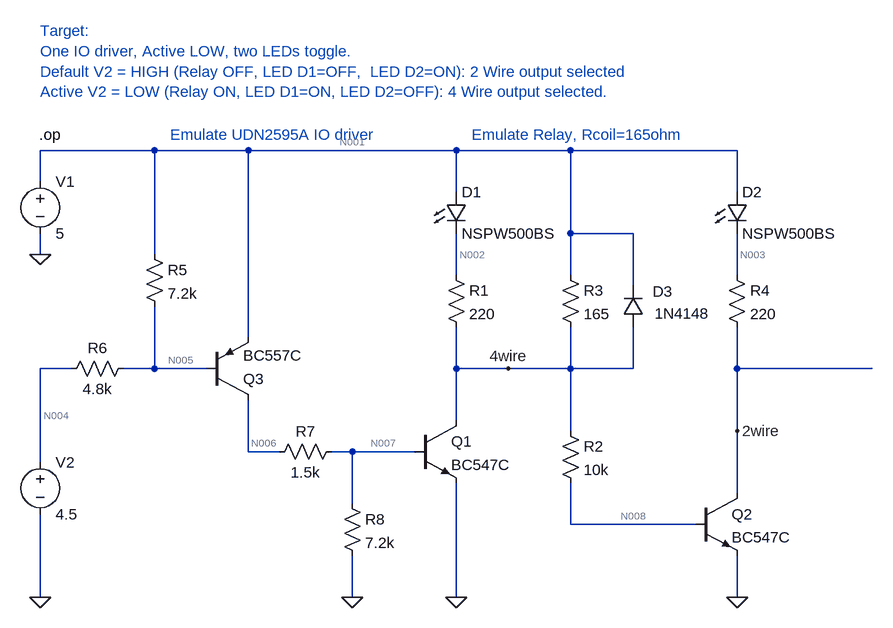
[diagram p0: schematic 2wire4wire_LED.asc]
2wire4wire_LED.asc, the LTspice schematic file:
Version 4
SHEET 1 948 680
WIRE -240 -256 -416 -256
WIRE -96 -256 -240 -256
WIRE 224 -256 -96 -256
WIRE 400 -256 224 -256
WIRE 656 -256 400 -256
WIRE -416 -208 -416 -256
WIRE 224 -192 224 -256
WIRE 656 -192 656 -256
WIRE 400 -128 400 -256
WIRE 496 -128 400 -128
WIRE -416 -96 -416 -128
WIRE -240 -96 -240 -256
WIRE 224 -64 224 -128
WIRE 400 -64 400 -128
WIRE 656 -64 656 -128
WIRE 496 -48 496 -128
WIRE -96 32 -96 -256
WIRE -368 80 -416 80
WIRE -240 80 -240 -16
WIRE -240 80 -288 80
WIRE -160 80 -240 80
WIRE 224 80 224 16
WIRE 304 80 224 80
WIRE 400 80 400 16
WIRE 400 80 304 80
WIRE 496 80 496 16
WIRE 496 80 400 80
WIRE 656 80 656 16
WIRE 864 80 656 80
WIRE 224 160 224 80
WIRE 400 176 400 80
WIRE 656 176 656 80
WIRE -96 208 -96 128
WIRE -48 208 -96 208
WIRE 64 208 32 208
WIRE 160 208 64 208
WIRE -416 224 -416 80
WIRE 656 272 656 176
WIRE 64 288 64 208
WIRE 400 320 400 256
WIRE 592 320 400 320
WIRE -416 432 -416 304
WIRE 64 432 64 368
WIRE 224 432 224 256
WIRE 656 432 656 368
FLAG 64 432 0
FLAG 224 432 0
FLAG 656 432 0
FLAG -416 -96 0
FLAG -416 432 0
FLAG 304 80 4wire
FLAG 656 176 2wire
DATAFLAG 400 80 ""
DATAFLAG 768 80 ""
SYMBOL npn 160 160 R0
SYMATTR InstName Q1
SYMATTR Value BC547C
SYMBOL npn 592 272 R0
SYMATTR InstName Q2
SYMATTR Value BC547C
SYMBOL pnp -160 128 M180
SYMATTR InstName Q3
SYMATTR Value BC557C
SYMBOL res 208 -80 R0
SYMATTR InstName R1
SYMATTR Value 220
SYMBOL res 384 160 R0
SYMATTR InstName R2
SYMATTR Value 10k
SYMBOL res 384 -80 R0
SYMATTR InstName R3
SYMATTR Value 165
SYMBOL res 640 -80 R0
SYMATTR InstName R4
SYMATTR Value 220
SYMBOL res -256 -112 R0
SYMATTR InstName R5
SYMATTR Value 7.2k
SYMBOL res -272 64 R90
WINDOW 0 0 56 VBottom 2
WINDOW 3 32 56 VTop 2
SYMATTR InstName R6
SYMATTR Value 4.8k
SYMBOL res 48 192 R90
WINDOW 0 0 56 VBottom 2
WINDOW 3 32 56 VTop 2
SYMATTR InstName R7
SYMATTR Value 1.5k
SYMBOL res 48 272 R0
SYMATTR InstName R8
SYMATTR Value 7.2k
SYMBOL LED 208 -192 R0
SYMATTR InstName D1
SYMATTR Value NSPW500BS
SYMATTR Description Diode
SYMATTR Type diode
SYMBOL LED 640 -192 R0
SYMATTR InstName D2
SYMATTR Value NSPW500BS
SYMATTR Description Diode
SYMATTR Type diode
SYMBOL voltage -416 -224 R0
WINDOW 123 0 0 Left 0
WINDOW 39 0 0 Left 0
SYMATTR InstName V1
SYMATTR Value 5
SYMBOL voltage -416 208 R0
WINDOW 123 0 0 Left 0
WINDOW 39 0 0 Left 0
SYMATTR InstName V2
SYMATTR Value 4.5
SYMBOL diode 512 16 R180
WINDOW 0 -45 55 Left 2
WINDOW 3 -102 21 Left 2
SYMATTR InstName D3
SYMATTR Value 1N4148
TEXT -418 -280 Left 2 !.op
TEXT -216 -280 Left 2 ;Emulate UDN2595A IO driver
TEXT 248 -280 Left 2 ;Emulate Relay, Rcoil=165ohm
TEXT -416 -440 Left 2 ;Target:\nOne IO driver, Active LOW, two LEDs toggle.\nDefault V2 = HIGH (Relay OFF, LED D1=OFF,  LED D2=ON): 2 Wire output selected\nActive V2 = LOW (Relay ON, LED D1=ON, LED D2=OFF): 4 Wire output selected.

The netlist it stands for:
* 2wire4wire_LED.asc
Q1 4wire N007 0 0 BC547C
Q2 2wire N008 0 0 BC547C
Q3 N006 N005 N001 0 BC557C
R1 N002 4wire 220
R2 4wire N008 10k
R3 N001 4wire 165
R4 N003 2wire 220
R5 N001 N005 7.2k
R6 N005 N004 4.8k
R7 N007 N006 1.5k
R8 N007 0 7.2k
D1 N001 N002 NSPW500BS
D2 N001 N003 NSPW500BS
V1 N001 0 5
V2 N004 0 4.5
D3 4wire N001 1N4148
.model D D
.lib standard.dio
.model NPN NPN
.model PNP PNP
.lib standard.bjt
.op
* Emulate UDN2595A IO driver
* Emulate Relay, Rcoil=165ohm
* Target:
* One IO driver, Active LOW, two LEDs toggle.
* Default V2 = HIGH (Relay OFF, LED D1=OFF,  LED D2=ON): 2 Wire output selected
* Active V2 = LOW (Relay ON, LED D1=ON, LED D2=OFF): 4 Wire output selected.
.backanno
.end

* Results of the author's LTspice run, read from the files saved beside the schematic
* Operating Point:
*   V(4wire) = 4.93 V
*   V(n007) = 46.91 µV
*   V(2wire) = 39.85 mV
*   V(n008) = 692.6 mV
*   V(n006) = 56.68 µV
*   V(n005) = 4.7 V
*   V(n001) = 5 V
*   V(n002) = 4.93 V
*   V(n003) = 1.919 V
*   V(n004) = 4.5 V
*   Ic(Q3) = -6.511 nA
*   Ib(Q3) = -21.31 pA
*   Ie(Q3) = 6.532 nA
*   Ic(Q2) = 8.541 mA
*   Ib(Q2) = 423.7 µA
*   Ie(Q2) = -8.964 mA
*   Ic(Q1) = 5.008 pA
*   Ib(Q1) = -4.957 pA
*   Ie(Q1) = -51.31 fA
*   I(D3) = -1.981 nA
*   I(D2) = 8.541 mA
*   I(D1) = 132.1 pA
*   I(R8) = 6.516 nA
*   I(R7) = -6.511 nA
*   I(R6) = 41.67 µA
*   I(R5) = 41.67 µA
*   I(R4) = 8.541 mA
*   I(R3) = 423.7 µA
*   I(R2) = 423.7 µA
*   I(R1) = 132.1 pA
*   I(V2) = 41.67 µA
*   I(V1) = -9.006 mA
* From the log:
*   Semiconductor Device Operating Points:
*                           --- Diodes ---
*   Name:      d3          d2          d1
*   Model:   1n4148     nspw500bs   nspw500bs
*   Id:     -1.98e-09    8.54e-03    1.32e-10
*   Vd:     -6.99e-02    3.08e+00    6.99e-02
*   Req:     8.41e+07    2.06e+01    4.37e+08
*   CAP:     3.89e-12    2.10e-10    4.36e-11
*                           --- Bipolar Transistors ---
*   Name:       q3          q2          q1
*   Model:    bc557c      bc547c      bc547c
*   Ib:      -2.13e-11    4.24e-04   -4.96e-12
*   Ic:      -6.51e-09    8.54e-03    5.01e-12
*   Vbe:     -3.00e-01    6.93e-01    4.69e-05
*   Vbc:      4.70e+00    6.53e-01   -4.93e+00
*   Vce:     -5.00e+00    3.98e-02    4.93e+00
*   BetaDC:   3.06e+02    2.02e+01   -1.01e+00
*   Gm:       2.48e-07    3.10e-01    1.96e-12
*   Rpi:      1.21e+09    8.69e+02    9.36e+11
*   Rx:       1.00e+00    1.00e+00    1.00e+00
*   Ro:       4.54e+09    7.73e+00    1.12e+15
*   Cbe:      2.01e-11    2.66e-10    1.23e-11
*   Cbc:      1.80e-12    1.87e-11    1.11e-12
*   Cjs:      0.00e+00    0.00e+00    0.00e+00
*   BetaAC:   3.00e+02    2.70e+02    1.84e+00
*   Cbx:      1.06e-12    1.15e-11    6.82e-13
*   Ft:       1.72e+03    1.67e+08    1.86e-02